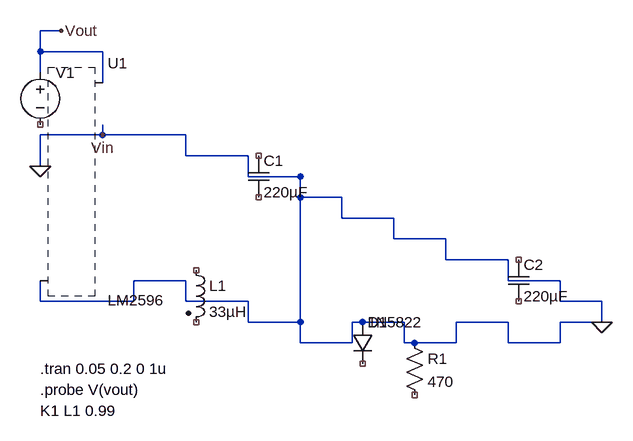
[diagram p0: schematic solar_charger.asc]
solar_charger.asc, the LTspice schematic file:
Version 4
SHEET 1 880 680
WIRE 64 64 -32 64
WIRE -32 64 -32 96
WIRE 64 64 64 112
WIRE 64 176 64 192
WIRE 64 192 -32 192
WIRE -32 192 -32 240
WIRE 64 192 192 192
WIRE 192 192 192 224
WIRE 192 224 288 224
WIRE 288 224 288 256
WIRE 288 256 368 256
WIRE 368 256 368 288
WIRE 368 288 432 288
WIRE 432 288 432 320
WIRE 432 320 512 320
WIRE 512 320 512 352
WIRE 512 352 592 352
WIRE 592 352 592 384
WIRE 592 384 688 384
WIRE 688 384 688 416
WIRE 688 416 768 416
WIRE 768 416 768 448
WIRE 768 448 832 448
WIRE 832 448 832 480
WIRE 832 480 768 480
WIRE 768 480 768 512
WIRE 768 512 688 512
WIRE 688 512 688 480
WIRE 688 480 608 480
WIRE 608 480 608 512
WIRE 608 512 528 512
WIRE 528 512 528 480
WIRE 528 480 448 480
WIRE 448 480 448 512
WIRE 448 512 368 512
WIRE 368 512 368 480
WIRE 368 480 288 480
WIRE 288 480 288 448
WIRE 288 448 192 448
WIRE 192 448 192 416
WIRE 192 416 112 416
WIRE 112 416 112 448
WIRE 112 448 -32 448
WIRE -32 448 -32 416
WIRE 368 256 368 480
WIRE -32 64 -32 32
WIRE -32 32 0 32
WIRE 64 176 64 192
FLAG 832 480 0
FLAG -32 240 0
FLAG 0 32 Vout
FLAG 64 192 Vin
SYMBOL voltage -32 80 R0
WINDOW 3 24 96 Invisible 0
WINDOW 123 24 0 Left 0
WINDOW 39 0 0 Left 0
SYMATTR Value SINE(0 12 1)
SYMATTR InstName V1
SYMBOL ind2 192 384 R0
SYMATTR Value 33µH
SYMATTR InstName L1
SYMBOL cap 288 224 R0
SYMATTR Value 220µF
SYMATTR InstName C1
SYMBOL diode 448 480 R0
WINDOW 3 24 0 Left 0
SYMATTR Value 1N5822
SYMATTR InstName D1
SYMBOL res 528 496 R0
SYMATTR Value 470
SYMATTR InstName R1
SYMBOL cap 688 384 R0
SYMATTR Value 220µF
SYMATTR InstName C2
SYMBOL LM2596 64 64 R0
SYMATTR Value LM2596
SYMATTR InstName U1
TEXT -32 552 Left 0 !.tran 0.05 0.2 0 1u
TEXT -32 584 Left 0 !.probe V(vout)
TEXT -32 616 Left 0 !K1 L1 0.99

The netlist it stands for:
* solar_charger.asc
V1 Vout NC_01 SINE(0 12 1)
L1 NC_02 NC_03 33µH
C1 NC_04 NC_05 220µF
D1 0 NC_06 1N5822
R1 0 NC_07 470
C2 NC_08 NC_09 220µF
* U1: LM2596 (symbol LM2596 not available, pin order unknown); nets seen at it: 0, Vout
.model D D
.lib standard.dio
.tran 0.05 0.2 0 1u
.probe V(vout)
K1 L1 0.99
.backanno
.end